# Altium schematic sheet PX4FMUv2.4.6_8.SchDoc
size 282 x 200 mm
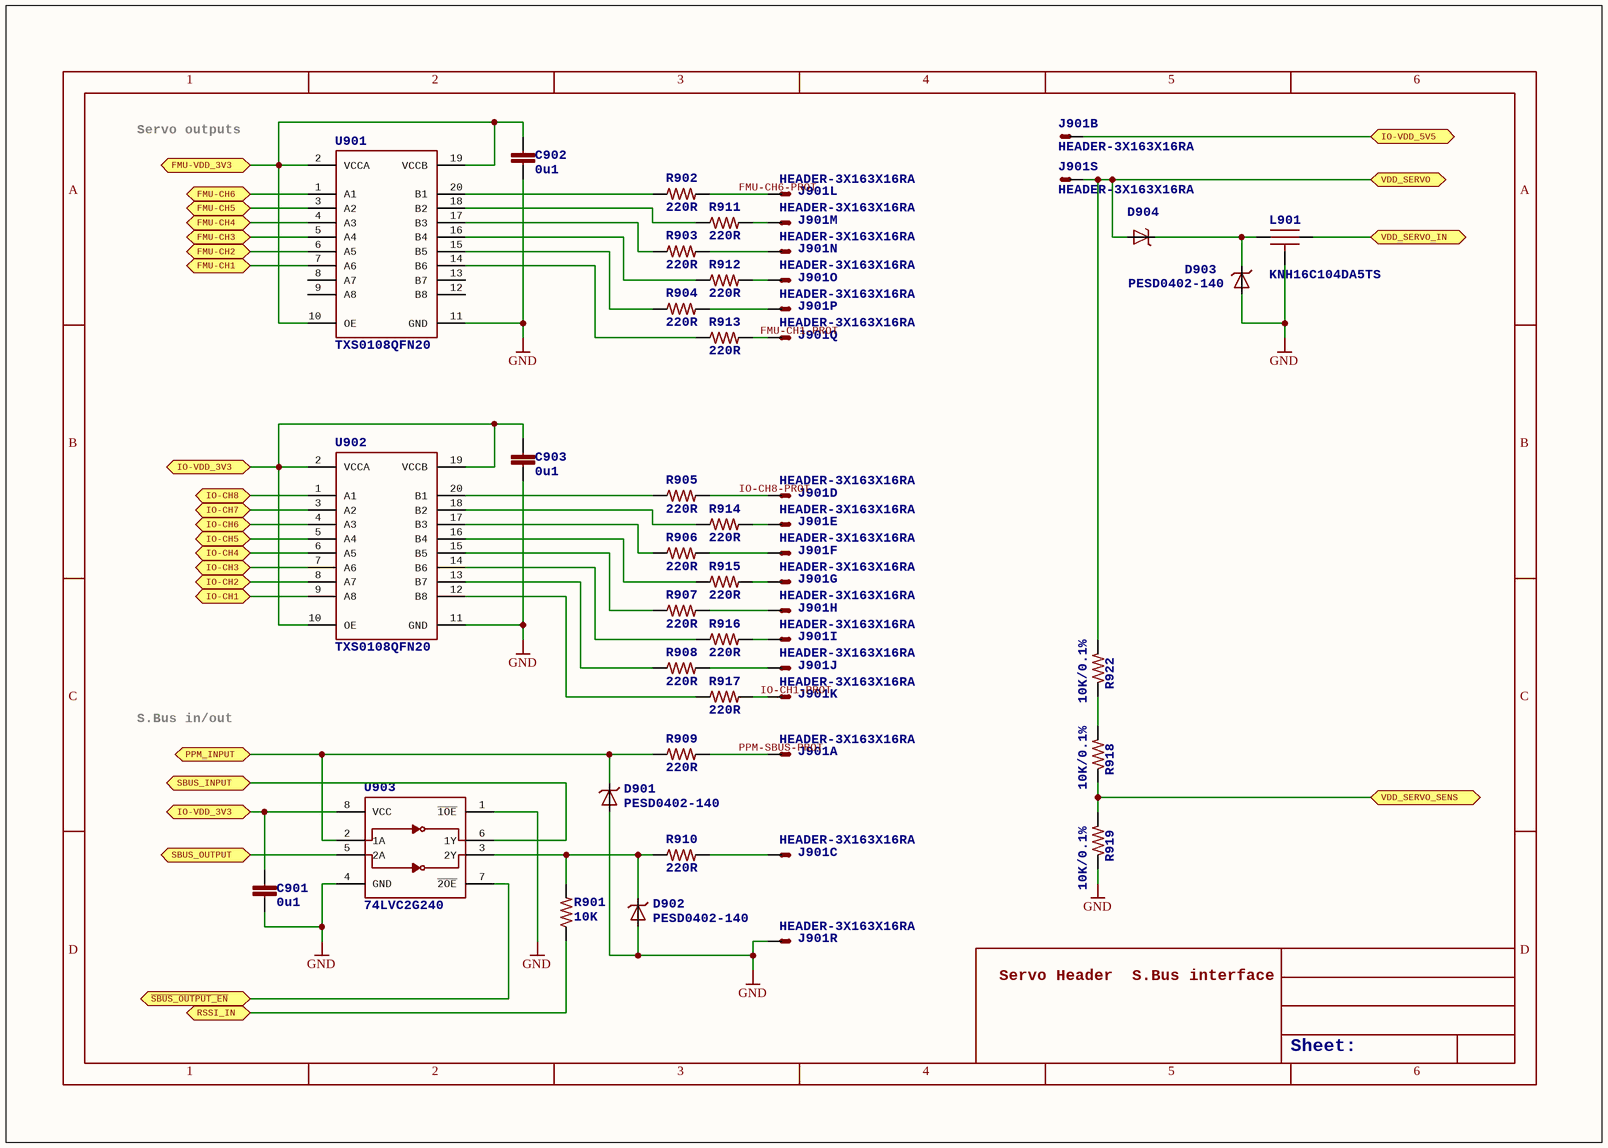
[diagram p0: PX4FMUv2.4.6_8.SchDoc]

## Parts
C901  0u1  [0402-CAP]
C902  0u1  [0402-CAP]
C903  0u1  [0402-CAP]
D901  PESD0402-140  [0402-TVS]
D902  PESD0402-140  [0402-TVS]
D903  PESD0402-140  [0402-TVS]
D904  MSS1P4-M3  [MICROSMP]  (value not drawn)
J901  HEADER-3X163X16RA  [3X16RA]  (parts A,B,C,D,E,F,G,H,I,J,K,L,M,N,O,P,Q,R,S of 19)
L901  KNH16C104DA5TS  [KYOCERA-KNH16-DA]
R901  10K  [0402-RES]
R902  220R  [0402-RES]
R903  220R  [0402-RES]
R904  220R  [0402-RES]
R905  220R  [0402-RES]
R906  220R  [0402-RES]
R907  220R  [0402-RES]
R908  220R  [0402-RES]
R909  220R  [0402-RES]
R910  220R  [0402-RES]
R911  220R  [0402-RES]
R912  220R  [0402-RES]
R913  220R  [0402-RES]
R914  220R  [0402-RES]
R915  220R  [0402-RES]
R916  220R  [0402-RES]
R917  220R  [0402-RES]
R918  10K/0.1%  [0402-RES]
R919  10K/0.1%  [0402-RES]
R922  10K/0.1%  [0402-RES]
U901  TXS0108QFN20  [QFN20-RGY]
U902  TXS0108QFN20  [QFN20-RGY]
U903  74LVC2G240  [TSSOP8_SOT505-2]

## Ports
FMU-CH1, FMU-CH2, FMU-CH3, FMU-CH4, FMU-CH5, FMU-CH6, FMU-VDD_3V3, IO-CH1, IO-CH2, IO-CH3, IO-CH4, IO-CH5, IO-CH6, IO-CH7, IO-CH8, IO-VDD_3V3, IO-VDD_5V5, PPM_INPUT, RSSI_IN, SBUS_INPUT, SBUS_OUTPUT, VDD_SERVO, VDD_SERVO_IN, VDD_SERVO_SENS, ~{SBUS_OUTPUT_EN}

## Nets
GND: C901.P$2 C902.P$2 C903.P$2 D901.A D902.A D903.A J901.3_6_9_12_15_18_21_24_27_30_33_36_39_42_45_48(S) L901.P$3_P$4_P$5(P$3) R919.P$1 U901.11(GND) U902.11(GND) U903.1(~{1OE}) U903.4(GND)
FMU-CH1: U901.7(A6) ; port FMU-CH1
FMU-CH1-PROT: J901.46(S) R913.P$2
FMU-CH2: U901.6(A5) ; port FMU-CH2
FMU-CH3: U901.5(A4) ; port FMU-CH3
FMU-CH4: U901.4(A3) ; port FMU-CH4
FMU-CH5: U901.3(A2) ; port FMU-CH5
FMU-CH6: U901.1(A1) ; port FMU-CH6
FMU-CH6-PROT: J901.31(S) R902.P$2
FMU-VDD_3V3: C902.P$1 U901.2(VCCA) U901.10(OE) U901.19(VCCB) ; port FMU-VDD_3V3
IO-CH1: U902.9(A8) ; port IO-CH1
IO-CH1-PROT: J901.28(S) R917.P$2
IO-CH2: U902.8(A7) ; port IO-CH2
IO-CH3: U902.7(A6) ; port IO-CH3
IO-CH4: U902.6(A5) ; port IO-CH4
IO-CH5: U902.5(A4) ; port IO-CH5
IO-CH6: U902.4(A3) ; port IO-CH6
IO-CH7: U902.3(A2) ; port IO-CH7
IO-CH8: U902.1(A1) ; port IO-CH8
IO-CH8-PROT: J901.7(S) R905.P$2
IO-VDD_3V3: C901.P$1 C903.P$1 U902.2(VCCA) U902.10(OE) U902.19(VCCB) U903.8(VCC) ; port IO-VDD_3V3
IO-VDD_5V5: J901.2(S) ; port IO-VDD_5V5
PPM-SBUS-PROT: J901.1(S) R909.P$2
PPM_INPUT: D901.C R909.P$1 U903.2(1A) ; port PPM_INPUT
RSSI_IN: R901.P$1 ; port RSSI_IN
~{SBUS_OUTPUT_EN}: U903.7(~{2OE}) ; port ~{SBUS_OUTPUT_EN}
SBUS_INPUT: U903.6(1Y) ; port SBUS_INPUT
SBUS_OUTPUT: U903.5(2A) ; port SBUS_OUTPUT
VDD_SERVO: D904.ANODE(A) J901.5_8_11_14_17_20_23_26_29_32_35_38_41_44_47(S) R922.P$2 ; port VDD_SERVO
VDD_SERVO_IN: L901.P$2 ; port VDD_SERVO_IN
VDD_SERVO_SENS: R918.P$1 R919.P$2 ; port VDD_SERVO_SENS
NetD902_C: D902.C R901.P$2 R910.P$1 U903.3(2Y)
NetD903_C: D903.C D904.CATHODE(C) L901.P$1
NetJ901_4: J901.4(S) R910.P$2
NetJ901_10: J901.10(S) R914.P$2
NetJ901_13: J901.13(S) R906.P$2
NetJ901_16: J901.16(S) R915.P$2
NetJ901_19: J901.19(S) R907.P$2
NetJ901_22: J901.22(S) R916.P$2
NetJ901_25: J901.25(S) R908.P$2
NetJ901_34: J901.34(S) R911.P$2
NetJ901_37: J901.37(S) R903.P$2
NetJ901_40: J901.40(S) R912.P$2
NetJ901_43: J901.43(S) R904.P$2
NetR902_P$1: R902.P$1 U901.20(B1)
NetR903_P$1: R903.P$1 U901.17(B3)
NetR904_P$1: R904.P$1 U901.15(B5)
NetR905_P$1: R905.P$1 U902.20(B1)
NetR906_P$1: R906.P$1 U902.17(B3)
NetR907_P$1: R907.P$1 U902.15(B5)
NetR908_P$1: R908.P$1 U902.13(B7)
NetR911_P$1: R911.P$1 U901.18(B2)
NetR912_P$1: R912.P$1 U901.16(B4)
NetR913_P$1: R913.P$1 U901.14(B6)
NetR914_P$1: R914.P$1 U902.18(B2)
NetR915_P$1: R915.P$1 U902.16(B4)
NetR916_P$1: R916.P$1 U902.14(B6)
NetR917_P$1: R917.P$1 U902.12(B8)
NetR918_P$2: R918.P$2 R922.P$1

Not connected (* = marked no-connect by the designer): U901 8(A7) 9(A8) 12(B8) 13(B7)

## Notes on the sheet
- Servo outputs
- S.Bus in/out
- Servo Header
  S.Bus interface
- Sheet:
- 1
- 2
- 3
- 4
- 5
- 6
- A
- B
- C
- D

## Library data of the parts
C901-C903 = CAP0402: CapacitorStandard 0603 ceramic capacitor, and 0.1" leaded capacitor.; PARTNO: CC0402ZRY5V7BB104
D901-D903 = DIODE-TVS
D904 = DIODE-SCHOTTKY_MSMP: Schottky barrier diode in DO214AC, e.g. Fairchild SS14.
J901 = HEADER-3X163X16RA: 3x16 servo header; BOM: EXCLUDE
L901 = KNH16C104DA5TS: Kyocera KNH16C104DA5TS EMI filter; PARTNO: KNH16C104DA5TS
R901 = RESISTOR0402-RES: ResistorBasic schematic elements and footprints for 0603, 1206, and PTH 1/10th watt (small) resistors.; PARTNO: RC0402FR-0710KL
R902-R917 = RESISTOR0402-RES: ResistorBasic schematic elements and footprints for 0603, 1206, and PTH 1/10th watt (small) resistors.; PARTNO: RC0402FR-07220RL
R918 R919 R922 = RESISTOR0402-RES: ResistorBasic schematic elements and footprints for 0603, 1206, and PTH 1/10th watt (small) resistors.
U901 U902 = TXS0108QFN20: PARTNO: TXS0108ERGYR
U903 = 74LVC2G240-TSSOP-8: Dual inverter tri-state, 3.3V/5V compatible  http://www.nxp.com/documents/data_sheet/74LVC2G240.pdf http://focus.ti.com/lit/ds/symlink/sn74lvc2g240.pdf; PARTNO: 74LVC2G240DP,125